# EAGLE design SensorStation Board v0.6 (EAGLE 7.7.0)
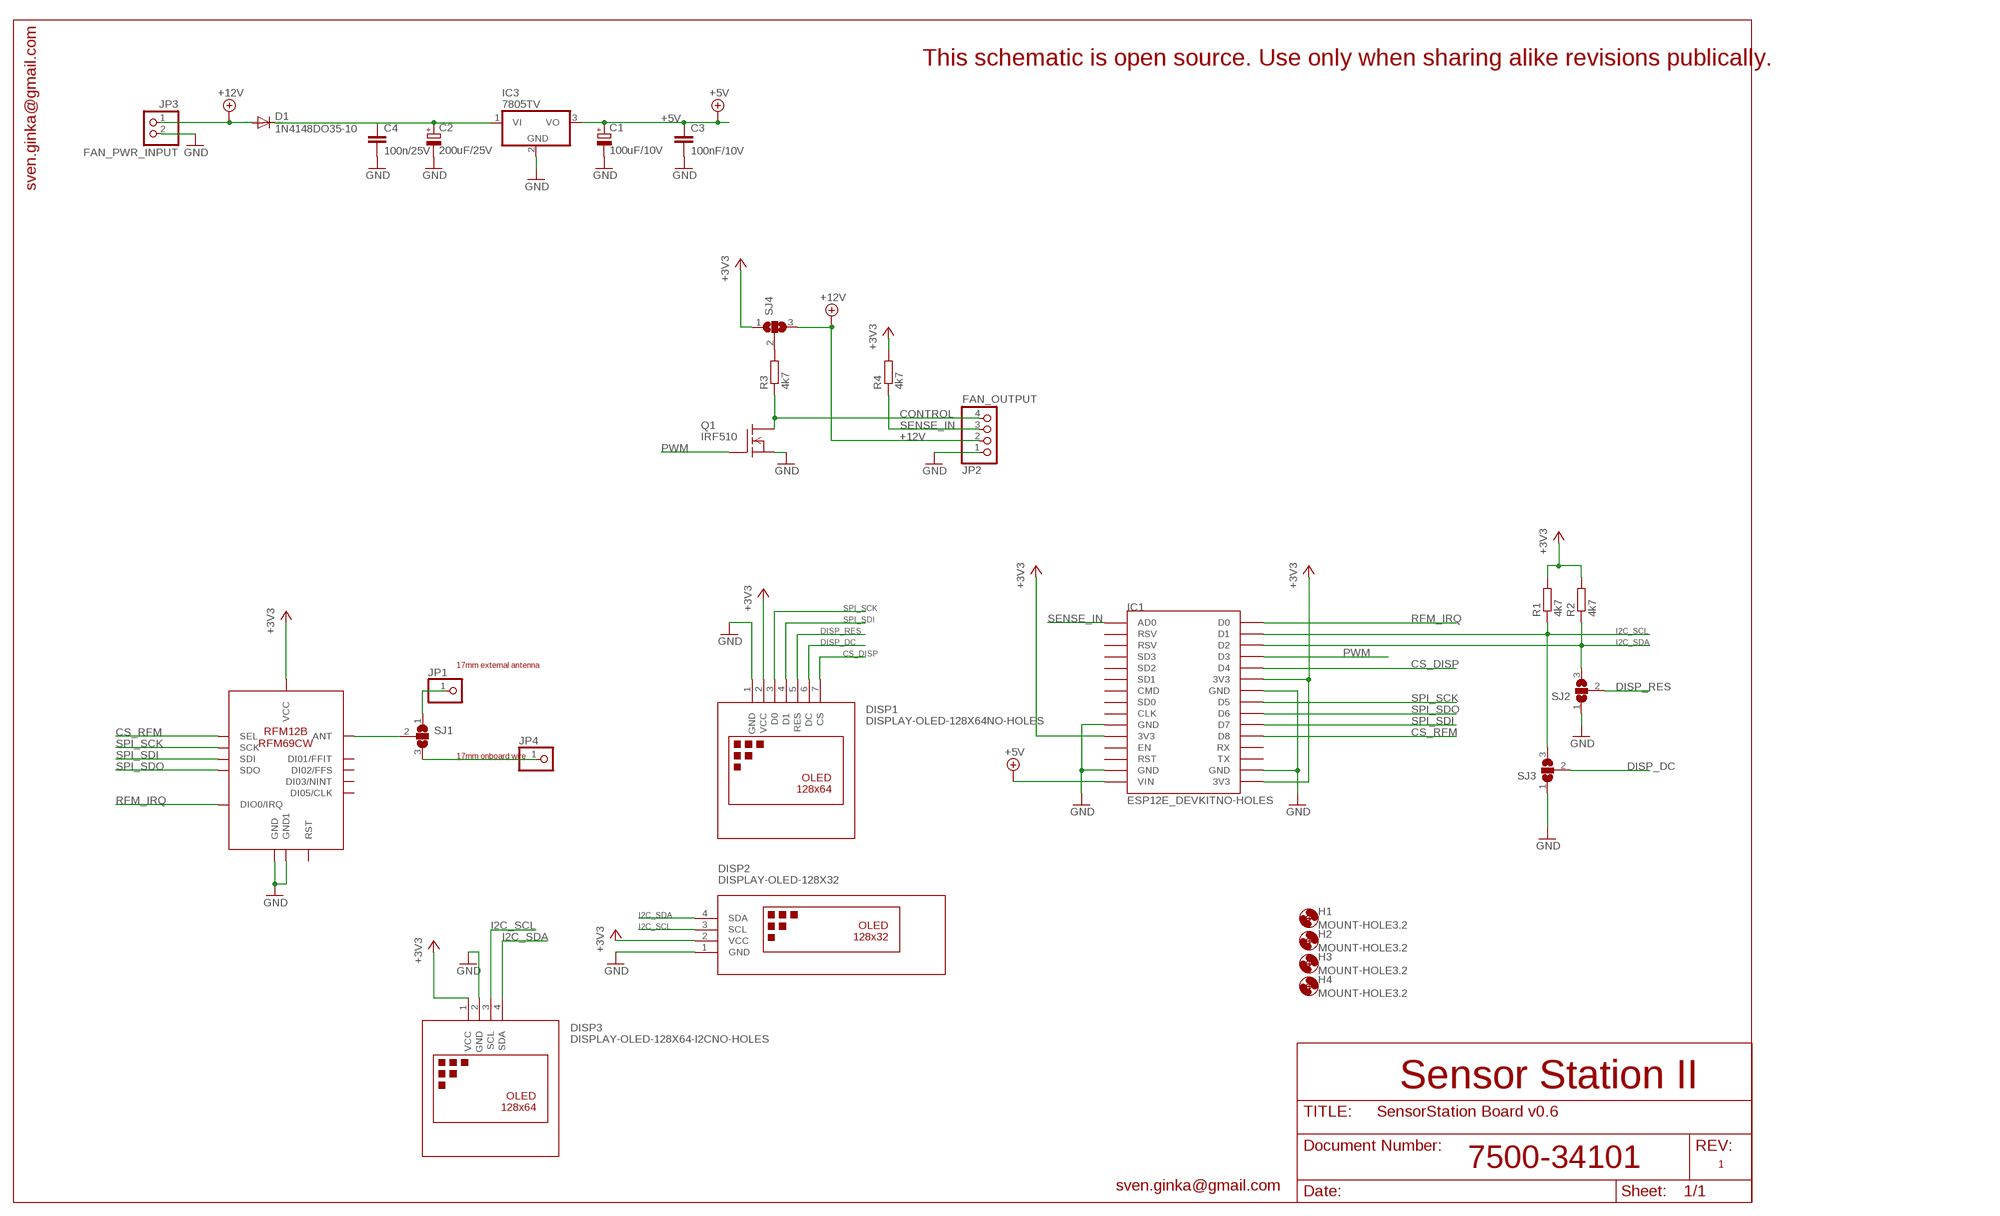
[diagram p0: schematic, sheet 1]

## Parts
C1  100uF/10V  CPOL-EUE2.5-6  [E2,5-6]
C2  200uF/25V  CPOL-EUE2.5-6  [E2,5-6]
C3  100nF/10V  C-EU025-025X050  [C025-025X050]
C4  100n/25V  C-EU025-025X050  [C025-025X050]
D1  1N4148DO35-10  [DO35-10]
DISP1  DISPLAY-OLED-128X64NO-HOLES  [DISPLAY-OLED-128X64-NO-HOLES]
DISP2  DISPLAY-OLED-128X32  [DISPLAY-OLED-128X32]
DISP3  DISPLAY-OLED-128X64-I2CNO-HOLES  [DISPLAY-OLED-128X64-I2C-NO-HOLES]
H1  MOUNT-HOLE3.2  [3,2]
H2  MOUNT-HOLE3.2  [3,2]
H3  MOUNT-HOLE3.2  [3,2]
H4  MOUNT-HOLE3.2  [3,2]
IC1  ESP12E_DEVKITNO-HOLES  [ESP12E_DEVKIT-NO-HOLES]
IC2  RFM12B/69CW  [RFM12B/69CW]
IC3  7805TV  [TO220V]
JP1  PINHD-1X1  [1X01]
JP2  FAN_OUTPUT  PINHD-1X4  [1X04]
JP3  FAN_PWR_INPUT  PINHD-1X2  [1X02]
JP4  PINHD-1X1  [1X01]
Q1  IRF510  [TO220]
R1  4k7  R-EU_0204/5  [0204/5]
R2  4k7  R-EU_0204/5  [0204/5]
R3  4k7  R-EU_0204/5  [0204/5]
R4  4k7  R-EU_0204/5  [0204/5]
SJ1  SJ2W  [SJ_2]
SJ2  SJ2W  [SJ_2]
SJ3  SJ2W  [SJ_2]
SJ4  SJ2W  [SJ_2]

## Nets
12V_INTERNAL: C2.+ C4.1 D1.C IC3.1(VI)
+3V3: DISP1.2(VCC) DISP2.2(VCC) DISP3.1(VCC) IC1.3V3@0(3V3) IC1.3V3@1(3V3) IC1.3V3@2(3V3) IC2.VDD(VCC) R1.2 R2.2 R4.2 SJ4.1
+5V: C1.+ C3.1 IC1.VIN IC3.3(VO)
+12V: D1.A JP2.2 JP3.1 SJ4.3
ANTENNA: JP4.1 SJ1.3
CONTROL: JP2.4 Q1.2(D) R3.1
CS_DISP: DISP1.7(CS) IC1.D4
CS_RFM: IC1.D8 IC2.SEL
DISP_DC: DISP1.6(DC) SJ3.2
DISP_RES: DISP1.5(RES) SJ2.2
EXT_ANTENNA: JP1.1 SJ1.1
GND: C1.- C2.- C3.2 C4.2 DISP1.1(GND) DISP2.1(GND) DISP3.2(GND) IC1.GND@0(GND) IC1.GND@1(GND) IC1.GND@2(GND) IC1.GND@3(GND) IC2.GND IC2.GND1 IC3.2(GND) JP2.1 JP3.2 Q1.3(S) SJ2.1 SJ3.1
I2C_SCL: DISP2.3(SCL) DISP3.3(SCL) IC1.D1 R1.1 SJ3.3
I2C_SDA: DISP2.4(SDA) DISP3.4(SDA) IC1.D2 R2.1 SJ2.3
N$1: IC2.ANT SJ1.2
N$3: R3.2 SJ4.2
PWM: IC1.D3 Q1.1(G)
RFM_IRQ: IC1.D0 IC2.IRQ(DIO0/IRQ)
SENSE_IN: IC1.AD0 JP2.3 R4.1
SPI_SCK: DISP1.3(D0) IC1.D5 IC2.SCK
SPI_SDI: DISP1.4(D1) IC1.D7 IC2.SDI
SPI_SDO: IC1.D6 IC2.SDO
Unconnected: IC1.CLK IC1.CMD IC1.EN IC1.RST IC1.RSV@0(RSV) IC1.RSV@1(RSV) IC1.RX IC1.SD0 IC1.SD1 IC1.SD2 IC1.SD3 IC1.TX IC2.CLK(DI05/CLK) IC2.FFIT(DI01/FFIT) IC2.FFS(DI02/FFS) IC2.NINT(DI03/NINT) IC2.RST

## Notes on the sheet
- This schematic is open source. Use only when sharing alike revisions publically.
- sven.ginka@gmail.com
- 17mm external antenna
- 17mm onboard wire
- Sensor Station II
- 7500-34101 | 1
- sven.ginka@gmail.com

## Library data of the parts
C1 C2 = rcl:CPOL-EU: POLARIZED CAPACITOR, European symbol
C3 C4 = rcl:C-EU: CAPACITOR, European symbol
D1 = diode:1N4148: DIODE high speed (Philips)
DISP1 = diy-modules:DISPLAY-OLED-128X64: 128x64 Dot Matrix OLED Module Click here to find device on ebay.com <http://www.ebay.com/sch/oled+display+128x64> Note: There are two variants: I2C and SPI. Search for the proper version.
DISP2 = diy-modules:DISPLAY-OLED-128X32: 128x32 Dot Matrix OLED Module with I2C interface based on SSD1306 chip More details available here: http://www.tinyosshop.com/index.php?route=product/product&product_id=953 Schematic available here: http://www.tinyosshop.com/datasheet/OLED%2012832.pdf SSD1306 datasheet: https://cdn-shop.adafruit.com/datasheets/SSD1306.pdf Click here to find device on ebay.com <http://www.ebay.com/sch/oled+display+128x32+i2c>
DISP3 = diy-modules:DISPLAY-OLED-128X64-I2C: OLED 0.96" 128x64 I2C Display ebay http://www.ebay.de/itm/0-96-OLED-LCD-Display-Weiss-I2C-128X64-fuer-Arduino-Mikrokontroller-/301943930819
H1-H4 = holes:MOUNT-HOLE: MOUNTING HOLE with drill center marker
IC1 = ESP12E_DEVKIT:ESP12E_DEVKIT: ESP12E DEVKIT BOARD
IC2 = JeeLabs:RFM12B/69CW
IC3 = linear:78*: Positive VOLTAGE REGULATOR Source: http://cache.national.com/ds/LM/LM78L05.pdf http://www.fairchildsemi.com/ds/LM/LM7805.pdf
JP1 JP4 = pinhead:PINHD-1X1: PIN HEADER
JP2 = pinhead:PINHD-1X4: PIN HEADER
JP3 = pinhead:PINHD-1X2: PIN HEADER
Q1 = transistor-fet:IRF510: N-Channel Enhancement MOSFET (HEXFET); 100V; 5,6A; 0,54Ohm
R1-R4 = rcl:R-EU_: RESISTOR, European symbol
SJ1-SJ4 = jumper:SJ2W: SMD solder JUMPER

## Board
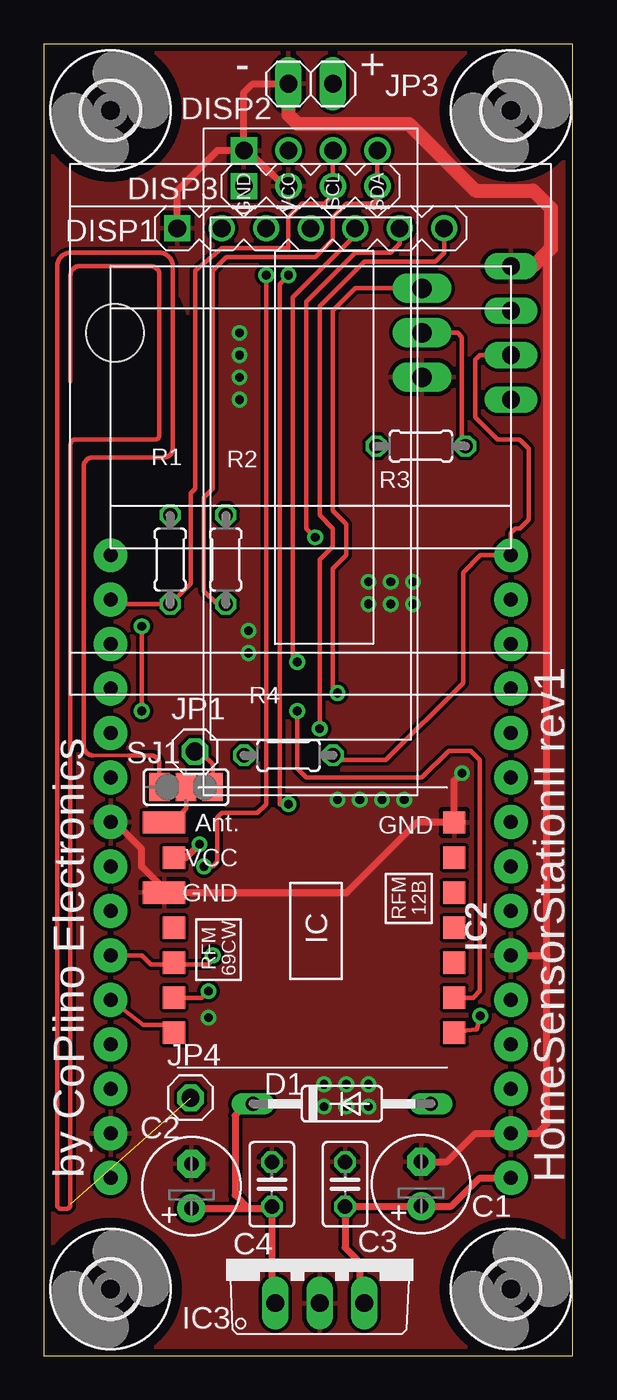
[diagram p1: board, top side]
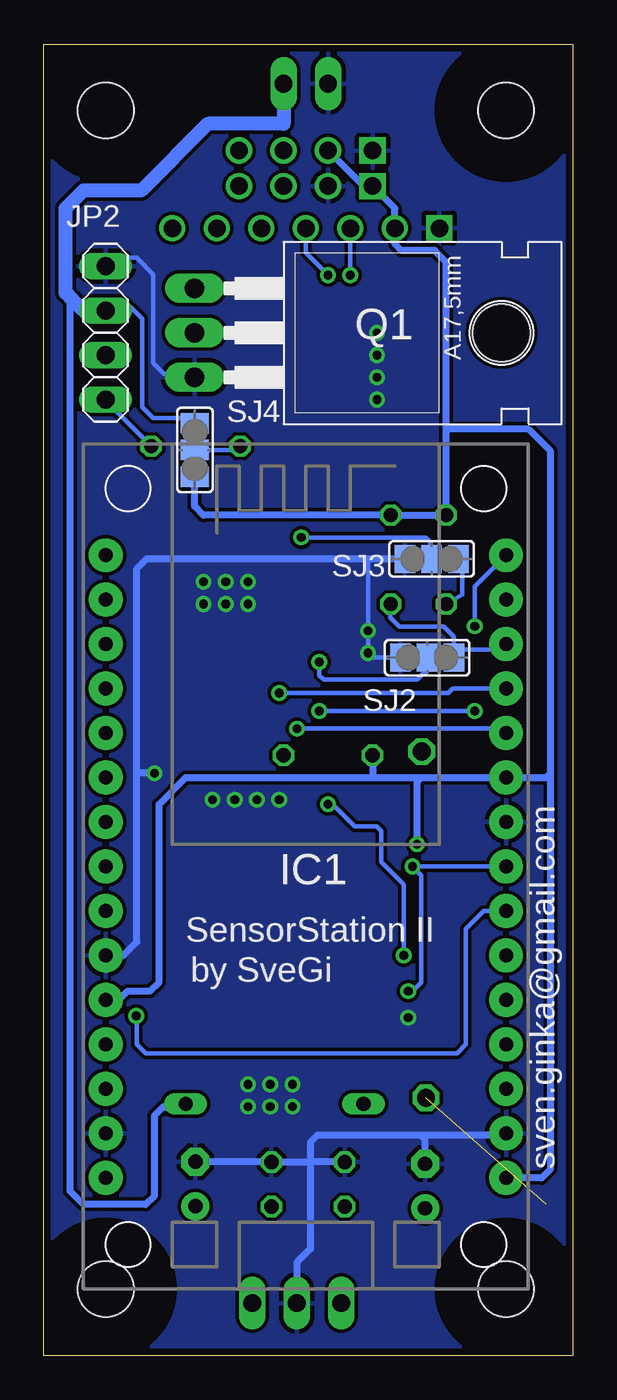
[diagram p2: board, bottom side, seen from below]

Size 30.2 x 74.9 mm. Coordinates in mm from the lower left corner, seen from the top.
Outline: 0,0 30.2,0 30.2,74.9 0,74.9 0,0
Copper layers (1*16): Top 0.035mm / dielectric 1.5mm / Bottom 0.035mm
Design rules "default": minimum track width 0.15mm, minimum drill 0.4mm, track to track 0.2mm, track to pad 0.2mm, pad to pad 0.2mm, via to via 0.2mm, smd to smd 0.2mm, copper to edge 0.4mm, drill to drill 0.3mm, minimum pad ring 0.2mm, minimum via ring 0.2mm, stop-mask expansion 4mil, vias tented up to drill 0mil, thermal gap 10mil

### Footprints (pad centres in the part's own frame; a part is rotated, then mirrored left to right if it is on the bottom)
E2,5-6 = drill 0.813 pad 1.6: + -1.27,0 | drill 0.813 pad 1.6 octagon: - 1.27,0
C025-025X050 = drill 0.813 octagon: 1 -1.27,0; 2 1.27,0
DO35-10 = drill 0.813 long: A 5.08,0; C -5.08,0
DISPLAY-OLED-128X64-NO-HOLES = drill 1 square: 1 -7.62,11.43 | drill 1: 2 -5.08,11.43; 3 -2.54,11.43; 4 0,11.43; 5 2.54,11.43; 6 5.08,11.43; 7 7.62,11.43
DISPLAY-OLED-128X32 = drill 1 square: 1 -17.78,-3.81 | drill 1: 2 -17.78,-1.27; 3 -17.78,1.27; 4 -17.78,3.81
DISPLAY-OLED-128X64-I2C-NO-HOLES = drill 1 square: 1 -3.81,11.43 | drill 1: 2 -1.27,11.43; 3 1.27,11.43; 4 3.81,11.43
3,2 = hole 3.2: 0,0
ESP12E_DEVKIT-NO-HOLES = drill 0.8 pad 1.93: 3V3@0 -11.43,-7.62; 3V3@1 11.43,5.08; 3V3@2 11.43,-17.78; AD0 -11.43,17.78; CLK -11.43,-2.54; CMD -11.43,2.54; D0 11.43,17.78; D1 11.43,15.24; D2 11.43,12.7; D3 11.43,10.16; D4 11.43,7.62; D5 11.43,0; D6 11.43,-2.54; D7 11.43,-5.08; D8 11.43,-7.62; EN -11.43,-10.16; GND@0 -11.43,-5.08; GND@1 -11.43,-15.24; GND@2 11.43,2.54; GND@3 11.43,-15.24; RST -11.43,-12.7; RSV@0 -11.43,15.24; RSV@1 -11.43,12.7; RX 11.43,-10.16; SD0 -11.43,0; SD1 -11.43,5.08; SD2 -11.43,7.62; SD3 -11.43,10.16; TX 11.43,-12.7; VIN -11.43,-17.78
RFM12B/69CW = smd 2.413 x 1.27: ANT 9.06,-6; GND 9.06,-2 | smd 1.27 x 1.27: CLK -7.5,-2; FFIT -7.5,0; FFS -7.5,2; GND1 -7.5,-6; IRQ -7.5,4; NINT 8.5,0; RST -7.5,-4; SCK 8.5,4; SDI 8.5,2; SDO -7.5,6; SEL 8.5,6; VDD 8.5,-4
TO220V = drill 1.016 long: 1 -2.54,-2.54; 2 0,-2.54; 3 2.54,-2.54
1X01 = drill 1.016 octagon: 1 0,0
1X04 = drill 1.016 long: 1 -3.81,0; 2 -1.27,0; 3 1.27,0; 4 3.81,0
1X02 = drill 1.016 long: 1 -1.27,0; 2 1.27,0
TO220 = drill 1.118 long: 1 -2.54,-6.35; 2 0,-6.35; 3 2.54,-6.35 | hole 3.302: 0,11.176
0204/5 = drill 0.813 octagon: 1 -2.54,0; 2 2.54,0
SJ_2 = smd 1.168 x 1.6: 1 -1.524,0; 2 0,0; 3 1.524,0

### Placement (x,y rotation side)
C1  21.54,9.81 90 top
C2  8.43,9.69 90 top
C3  17.2,9.79 90 top
C4  13.02,9.79 90 top
D1  17.02,14.39 0 top
DISP1  15.24,52.96 0 top
DISP2  15.24,51.05 270 top
DISP3  15.24,55.37 0 top
H1  3.81,3.81 0 top
H2  26.67,3.81 0 top
H3  26.67,71.12 0 top
H4  3.81,71.12 0 top
IC1  15.24,27.94 0 bottom
IC2  15.93,24.45 180 top
IC3  15.75,5.55 0 top
JP1  8.63,34.5 0 top
JP2  26.67,58.42 270 bottom
JP3  15.24,72.64 180 top
JP4  8.38,14.73 0 top
Q1  15.24,58.42 270 bottom
R1  7.22,45.47 90 top
R2  10.39,45.47 90 top
R3  21.53,51.95 180 top
R4  13.97,34.29 180 top
SJ1  8.12,32.47 180 top
SJ2  8.31,39.87 0 bottom
SJ3  8.06,45.51 0 bottom
SJ4  21.57,51.73 90 bottom

### Tracks (layer width: path | path; a pad name or v marks a point on that pad's centre or on a via)
12V_INTERNAL
  Top 0.406: C2.+ 11.68,8.42 | 11.68,8.42 12.93,8.42 C4.1 13.02,3.19 IC3.1 | D1.C 11.59,14.39 10.92,13.72 10.92,9.19 11.68,8.42
+3V3  (via drill 0.5 pad 0.41)
  Top 0.406: IC2.VDD 8.13,28.45 v8.89,29.21
  Bottom 0.406: 1.26,33.27 1.26,10.68 1.78,10.16 IC1.3V3@2 | 1.26,33.27 1.26,51.66 2.52,52.92 7.05,52.92 7.22,53.09 | 4.15,33.02 IC1.3V3@1 | IC1.3V3@0 25.91,20.32 25.4,20.83 24.13,20.83 23.62,21.34 23.62,31.5 22.1,33.02 11.43,33.02 | 11.43,33.02 8.64,33.02 | 8.64,33.02 IC1.3V3@1 | R4.2 11.43,33.02 | v8.89,29.21 8.89,32.77 8.64,33.02 | SJ4.1 21.59,50.19 21.59,48.51 21.09,48.01 R2.2 R1.2 7.22,53.09 | 7.22,53.09 7.22,62.47 7.87,63.12 9.78,63.12 10.16,63.5 DISP1.2 10.16,65.53 DISP3.1 11.94,66.8 DISP2.2 | IC1.3V3@1 1.51,33.02 1.26,33.27
+5V
  Top 0.406: IC3.3 18.03,3.26 18.03,5.33 17.2,6.17 C3.1 21.52,8.52 C1.+ 23.27,8.54 24.89,10.16 IC1.VIN
+12V
  Bottom 0.254: SJ4.3 21.87,53.55 23.94,53.55 24.57,54.18 24.57,59.22 25.2,59.85 25.83,59.85 25.99,59.69 JP2.2
  Bottom 0.406: D1.A 22.26,14.22 23.37,14.22 23.88,13.72 23.88,9.14 24.38,8.64 27.94,8.64 28.7,9.4 28.7,60.2 28.57,60.33
  Bottom 0.813: JP3.1 16.51,70.36 20.83,70.36 24.64,66.55 27.94,66.55 28.96,65.53 28.96,60.71 28.57,60.33 27.94,59.69 JP2.2
ANTENNA  (1 unrouted)
  Top 0.2: 4.83,34.29 2.79,34.29
  Top 0.254: SJ1.3 6.6,32.47 6.6,33.78 arc90 6.1,34.29 4.83,34.29 | 2.79,34.29 arc-90 2.29,34.8 2.29,50.8 arc-90 2.79,51.31 6.86,51.31 arc90 7.37,51.82 7.37,62.23 arc90 6.6,62.99 1.52,62.99 arc90 0.76,62.23 0.76,8.64 arc90 1.02,8.38 1.27,8.38 arc90 1.52,8.64 1.52,52.07 arc-90 1.78,52.32 6.35,52.32 arc90 6.6,52.58 6.6,61.72 arc90 6.1,62.23 2.03,62.23 arc90 1.52,61.72 1.52,55.63
CONTROL
  Top 0.254: Q1.2 23.62,58.42 23.88,58.17 23.88,52.14 R3.1
  Bottom 0.254: JP2.4 26.67,54.55 R3.1
CS_DISP  (via drill 0.5 pad 0.41)
  Top 0.254: DISP1.7 22.86,62.99 22.35,62.48 18.29,62.48 15.75,59.94 15.75,48.01 16.51,47.24 16.51,46.23 15.75,45.47 v15.75,35.81
  Bottom 0.254: v15.75,35.81 4.57,35.81 4.32,35.56 IC1.D4
CS_RFM
  Top 0.254: IC1.D8 5.67,18.9 7.56,18.9 IC2.SEL
DISP_DC  (via drill 0.5 pad 0.41)
  Top 0.254: DISP1.6 20.32,63.5 19.81,62.99 17.78,62.99 14.99,60.2 14.99,47.24 v15.49,46.74
  Bottom 0.254: v15.49,46.74 8.38,46.74 8.13,46.48 8.13,45.58 SJ3.2
DISP_RES  (via drill 0.5 pad 0.41)
  Top 0.254: DISP1.5 17.78,64.01 14.22,60.45 14.22,39.88 v14.48,39.62
  Bottom 0.254: v14.48,39.62 14.48,38.86 14.22,38.61 8.89,38.61 8.38,39.12 8.38,39.8 SJ2.2
EXT_ANTENNA
  Top 0.254: SJ1.1 9.64,33.79 9.14,34.29 8.84,34.29 JP1.1
GND  (via drill 0.5, 0.5 pad 0.41)
  Top 0.406: 28.73,22.86 28.73,13.23 28.2,12.7 IC1.GND@1 24.64,12.7 23.02,11.08 C1.- 21.52,11.06 | 28.73,22.86 28.73,62.97 28.7,62.99 | IC2.GND1 23.31,30.87 | IC2.GND1 23.4,30.48 21.34,30.48 17.31,26.45 IC2.GND 6.87,26.66 5.59,27.94 5.59,28.96 4.57,29.97 4.32,29.97 IC1.GND@2 | IC2.GND1 23.43,32.83 v23.88,33.27 | DISP1.1 7.62,66.55 9.91,68.83 DISP2.1 | DISP2.1 11.43,72.14 11.94,72.64 JP3.2 | IC1.GND@0 28.73,22.86 | DISP3.2 13.72,66.8 11.94,68.58 11.68,68.58 DISP2.1
  Top 0.813: JP3.2 13.97,70.87 14.48,70.36 20.83,70.36 24.64,66.55 27.94,66.55 28.96,65.53 28.96,63.25 28.7,62.99 27.94,62.23 JP2.1
  Bottom 0.254: Q1.3 21.78,56.07 23.31,56.07 23.94,56.7 23.94,61.74 24.9,62.7 26.18,62.7 26.65,62.23 JP2.1 | SJ2.1 11.42,39.87 v11.68,40.13 11.68,45.47
  Bottom 0.406: 8.64,12.6 3.91,12.6 IC1.GND@3 | 8.64,12.6 14.58,12.6 14.99,12.19 14.99,11.18 | 14.99,11.18 14.99,6.1 15.75,5.33 IC3.2 | 14.99,11.18 15.1,11.06 C3.2 21.52,11.06 C1.- | C4.2 14.87,11.06 14.99,11.18 | C2.- 8.43,12.4 8.64,12.6 | SJ3.1 11.68,45.51 | 11.68,45.51 24.34,45.51 24.89,44.96 24.89,33.27 | IC1.GND@0 25.65,22.86 24.89,23.62 24.89,33.27 | v23.88,33.27 24.89,33.27 | 11.68,45.47 11.68,45.51
  other vias: 18.54,44.2 19.81,44.2 21.08,44.2 18.54,42.93 19.81,42.93 21.08,42.93 16,15.49 17.27,15.49 18.54,15.49 16,14.22 17.27,14.22 18.54,14.22 9.4,19.3 16.76,31.75 18.03,31.75 19.3,31.75 20.57,31.75 11.18,57.15 11.18,55.88 11.18,54.61 11.18,58.42 11.68,41.4
  pour Bottom: 0,74.93 30.23,74.93 30.23,0 0,0
  pour Top: 0,74.93 30.23,74.93 30.23,0 0,0
I2C_SCL
  Top 0.254: IC1.D1 4.32,43.18 4.57,42.93 R1.1 8.38,44.09 8.38,49.28 8.64,49.53 8.64,61.98 10.16,63.25 13.97,63.25 13.97,65.02 14.73,65.79 16,65.79 16.51,66.29 DISP3.3 DISP2.3
  Bottom 0.254: SJ3.3 6.3,44.73 6.3,43.47 R1.1
I2C_SDA
  Top 0.254: R2.1 9.9,42.93 9.14,43.69 9.14,49.02 9.65,49.53 9.65,61.98 10.41,62.74 15.49,62.74 16.51,63.75 16.51,65.02 17.27,65.79 18.8,65.79 19.05,66.04 DISP3.4 DISP2.4
  Bottom 0.254: IC1.D2 4.41,40.32 6.3,40.32 SJ2.3 6.79,41.08 7.37,41.66 9.91,41.66 10.41,42.16 10.41,42.91 R2.1
N$1
  Top 0.254: IC2.ANT 7.34,30.45 8.13,31.24 SJ1.2
N$3
  Bottom 0.254: R3.2 19.21,51.73 SJ4.2
PWM  (via drill 0.5 pad 0.41)
  Top 0.254: Q1.1 17.78,60.96 16.51,59.69 16.51,48.26 17.27,47.5 17.27,45.72 16.51,44.96 16.51,38.1 v16.76,37.85
  Bottom 0.254: v16.76,37.85 7.11,37.85 6.86,38.1 IC1.D3
RFM_IRQ  (via drill 0.5 pad 0.41)
  Top 0.254: IC2.IRQ 24.51,20.45 24.89,20.83 24.89,34.04 24.38,34.54 23.11,34.54 21.59,33.02 14.99,33.02 14.48,33.53 v14.48,36.83 | v5.59,36.83 v5.59,41.66
  Bottom 0.254: v14.48,36.83 v5.59,36.83 | v5.59,41.66 5.59,43.94 IC1.D0
SENSE_IN
  Top 0.254: R4.1 16.78,34.02 19.53,34.02 23.94,38.43 23.94,44.73 24.93,45.72 IC1.AD0 26.67,46.99 26.92,47.24 27.18,47.24 27.69,47.75 27.69,51.82 27.18,52.32 25.91,52.32 24.64,53.59 24.64,56.9 24.89,57.15 JP2.3
SPI_SCK  (via drill 0.5 pad 0.41)
  Top 0.254: IC2.SCK 9.02,20.45 v9.4,20.83 | v9.14,27.94 9.65,27.94 9.91,28.19 9.91,30.73 10.16,30.99 12.19,30.99 12.7,31.5 v12.7,61.72
  Bottom 0.254: v9.4,20.83 9.14,20.83 8.64,21.34 8.64,27.43 v9.14,27.94 IC1.D5 | v12.7,61.72 DISP1.3
SPI_SDI  (via drill 0.5 pad 0.41)
  Top 0.254: IC1.D7 5.59,22.86 6.1,22.35 7.33,22.35 IC2.SDI 7.53,22.35 9.4,22.35 9.65,22.61 v9.65,22.86 | v13.97,31.5 13.46,31.5 13.46,61.21 v13.97,61.72
  Bottom 0.254: v9.65,22.86 9.65,26.92 10.92,28.19 10.92,29.97 11.18,30.23 12.45,30.23 13.72,31.5 v13.97,31.5 | v13.97,61.72 15.24,62.99 DISP1.4
SPI_SDO  (via drill 0.5 pad 0.41)
  Top 0.254: v24.92,19.41 24.72,18.65 23.57,18.52 IC2.SDO
  Bottom 0.254: IC1.D6 5.08,25.4 6.1,24.38 6.1,17.78 6.6,17.27 24.38,17.27 24.89,17.78 24.89,19.38 v24.92,19.41

### Text on the board
tNames: - | + | by CoPiino Electronics | HomeSensorStationII rev1
bNames: SensorStation II | by SveGi | sven.ginka@gmail.com
Measures: 30.48mm | 74.93mm